# Altium schematic sheet MCU.SchDoc
size A
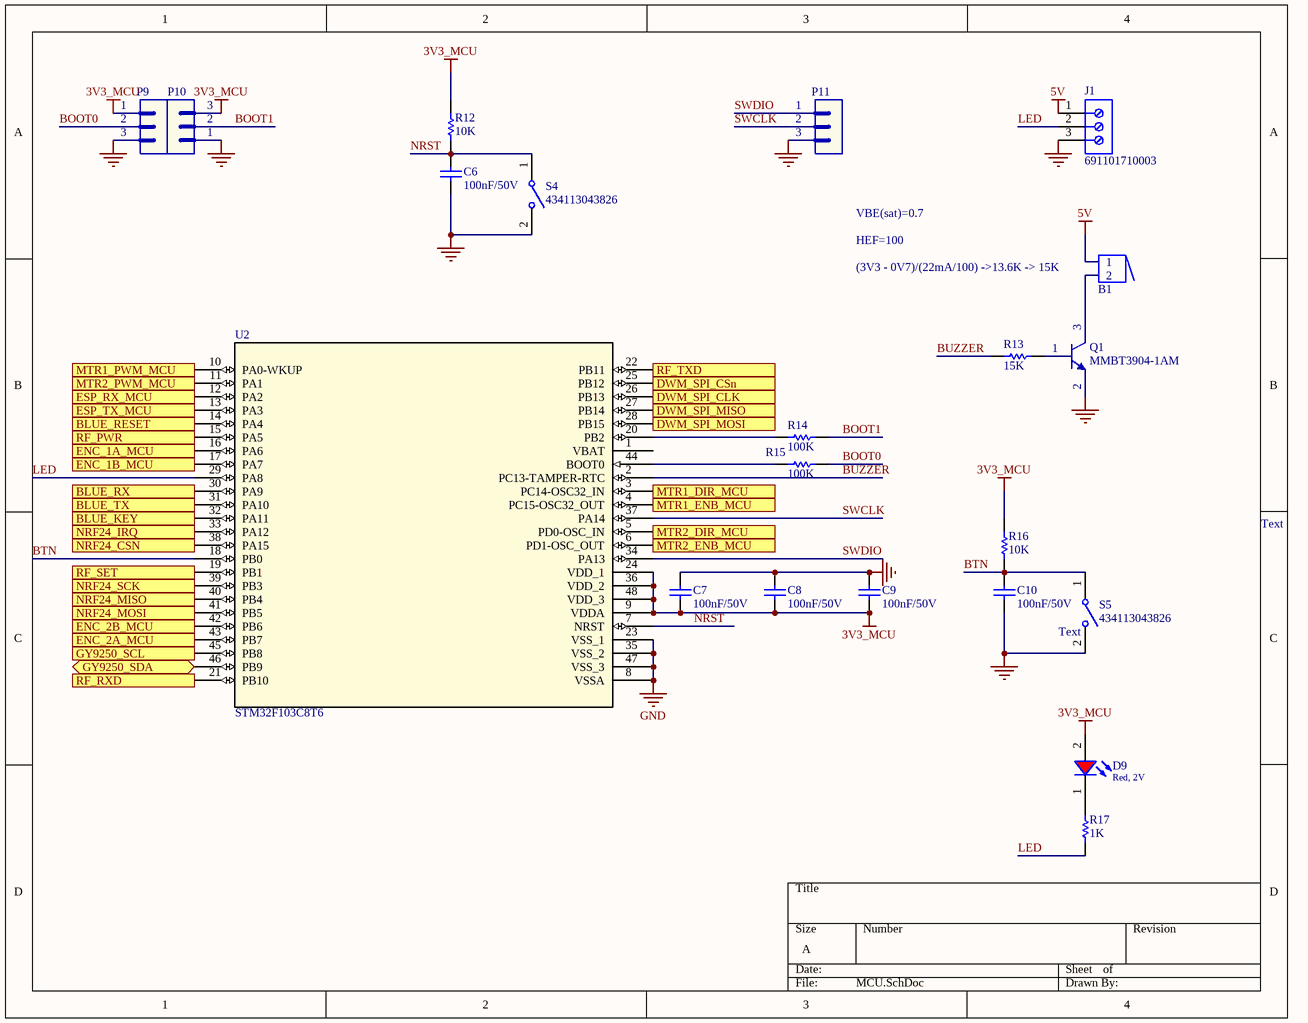
[diagram p0: MCU.SchDoc]

## Parts
B1  Buzzer  [BUZZER]  (value not drawn)
C6  value 100nF/50V  [CAP-SM-0805]  (hidden comment: Cap-100nF-50V-0805)
C7  value 100nF/50V  [CAP-SM-0805]  (hidden comment: Cap-100nF-50V-0805)
C8  value 100nF/50V  [CAP-SM-0805]  (hidden comment: Cap-100nF-50V-0805)
C9  value 100nF/50V  [CAP-SM-0805]  (hidden comment: Cap-100nF-50V-0805)
C10  value 100nF/50V  [CAP-SM-0805]  (hidden comment: Cap-100nF-50V-0805)
D9  Red, 2V  [WL-SMCW_0805]
J1  691101710003  [691101710003]
P9  (no value)  [JP3]
P10  (no value)  [JP3]
P11  (no value)  [JP3]
Q1  MMBT3904-1AM  [SOT23_NEX]
R12  value 10K  [RES-SM-0805]  (hidden comment: Res-10k-0805)
R13  value 15K  [RES-SM-0805]  (hidden comment: Res-15K-0805)
R14  value 100K  [RES-SM-0805]  (hidden comment: Res-100K-0805)
R15  value 100K  [RES-SM-0805]  (hidden comment: Res-100K-0805)
R16  value 10K  [RES-SM-0805]  (hidden comment: Res-10k-0805)
R17  value 1K  [RES-SM-0805]  (hidden comment: Res-1K-0805)
S4  434113043826  [434113043826]
S5  434113043826  [434113043826]
U2  STM32F103C8T6  [LQFP-48]

## Ports
BLUE_KEY (out), BLUE_RESET (out), BLUE_RX (out), BLUE_TX (in), DWM_SPI_CLK (out), DWM_SPI_CSn (out), DWM_SPI_MISO (in), DWM_SPI_MOSI (out), ENC_1A_MCU (in), ENC_1B_MCU (in), ENC_2A_MCU (in), ENC_2B_MCU (in), ESP_RX_MCU (out), ESP_TX_MCU (in), GY9250_SCL (out), GY9250_SDA (bidir), MTR1_DIR_MCU (out), MTR1_ENB_MCU (out), MTR1_PWM_MCU (out), MTR2_DIR_MCU (out), MTR2_ENB_MCU (out), MTR2_PWM_MCU (out), NRF24_CSN (out), NRF24_IRQ (in), NRF24_MISO (in), NRF24_MOSI (out), NRF24_SCK (out), RF_PWR (out), RF_RXD (out), RF_SET (out), RF_TXD (in)

## Nets
3V3_MCU: C7.1 C8.1 C9.1 D9.2(A) P9.1 P10.3 R12.1 R16.1 U2.9(VDDA) U2.24(VDD_1) U2.36(VDD_2) U2.48(VDD_3)
5V: B1.1 J1.1
GND: C6.1 C7.2 C8.2 C9.2 C10.1 J1.3 P9.3 P10.1 P11.3 Q1.2(E) S4.2 S5.2 U2.8(VSSA) U2.23(VSS_1) U2.35(VSS_2) U2.47(VSS_3)
BLUE_KEY: U2.32(PA11) ; port BLUE_KEY
BLUE_RESET: U2.14(PA4) ; port BLUE_RESET
BLUE_RX: U2.30(PA9) ; port BLUE_RX
BLUE_TX: U2.31(PA10) ; port BLUE_TX
BOOT0: P9.2 R15.2
BOOT1: P10.2 R14.2
BTN: C10.2 R16.2 S5.1 U2.18(PB0)
BUZZER: R13.1 U2.2(PC13-TAMPER-RTC)
DWM_SPI_CLK: U2.26(PB13) ; port DWM_SPI_CLK
DWM_SPI_CSn: U2.25(PB12) ; port DWM_SPI_CSn
DWM_SPI_MISO: U2.27(PB14) ; port DWM_SPI_MISO
DWM_SPI_MOSI: U2.28(PB15) ; port DWM_SPI_MOSI
ENC_1A_MCU: U2.16(PA6) ; port ENC_1A_MCU
ENC_1B_MCU: U2.17(PA7) ; port ENC_1B_MCU
ENC_2A_MCU: U2.43(PB7) ; port ENC_2A_MCU
ENC_2B_MCU: U2.42(PB6) ; port ENC_2B_MCU
ESP_RX_MCU: U2.12(PA2) ; port ESP_RX_MCU
ESP_TX_MCU: U2.13(PA3) ; port ESP_TX_MCU
GY9250_SCL: U2.45(PB8) ; port GY9250_SCL
GY9250_SDA: U2.46(PB9) ; port GY9250_SDA
LED: J1.2 R17.1 U2.29(PA8)
MTR1_DIR_MCU: U2.3(PC14-OSC32_IN) ; port MTR1_DIR_MCU
MTR1_ENB_MCU: U2.4(PC15-OSC32_OUT) ; port MTR1_ENB_MCU
MTR1_PWM_MCU: U2.10(PA0-WKUP) ; port MTR1_PWM_MCU
MTR2_DIR_MCU: U2.5(PD0-OSC_IN) ; port MTR2_DIR_MCU
MTR2_ENB_MCU: U2.6(PD1-OSC_OUT) ; port MTR2_ENB_MCU
MTR2_PWM_MCU: U2.11(PA1) ; port MTR2_PWM_MCU
NRF24_CSN: U2.38(PA15) ; port NRF24_CSN
NRF24_IRQ: U2.33(PA12) ; port NRF24_IRQ
NRF24_MISO: U2.40(PB4) ; port NRF24_MISO
NRF24_MOSI: U2.41(PB5) ; port NRF24_MOSI
NRF24_SCK: U2.39(PB3) ; port NRF24_SCK
NRST: C6.2 R12.2 S4.1 U2.7(NRST)
RF_PWR: U2.15(PA5) ; port RF_PWR
RF_RXD: U2.21(PB10) ; port RF_RXD
RF_SET: U2.19(PB1) ; port RF_SET
RF_TXD: U2.22(PB11) ; port RF_TXD
SWCLK: P11.2 U2.37(PA14)
SWDIO: P11.1 U2.34(PA13)
NetB1_2: B1.2 Q1.3(C)
NetD9_1: D9.1(K) R17.2
NetQ1_1: Q1.1(B) R13.2
NetR14_1: R14.1 U2.20(PB2)
NetR15_1: R15.1 U2.44(BOOT0)

Not connected (* = marked no-connect by the designer): U2 1(VBAT)

## Notes on the sheet
- VBE(sat)=0.7
- HEF=100
- (near B1) (3V3 - 0V7)/(22mA/100) ->13.6K -> 15K
- Text
- (near S5) Text

## Library data of the parts
C6-C10 = Cap-100nF-50V-0805: CAP CER 0.1UF 50V Y5V 0805; Manufacturer: Samsung Electro-Mechanics; Manufacturer Part Number: CL21F104ZBCNNNC; Local Supplier: thegioiic; Local Supplier Link: https://thegioiic.com/products/tu-100nf-0-1uf-50v-0805; Supplier 1: Digikey; Supplier 1 Part Number: 1276-1007-1-ND; Supplier 1 Link: https://www.digikey.com/product-detail/en/samsung-electro-mechanics/CL21F104ZBCNNNC/1276-1007-1-ND/3889093
D9 = 150080RS75000: WL-SMCW SMT Mono-color Chip LED Waterclear, size 0805, Red, 2V, 140deg; Chip Technology: AlInGaP; Dominant Wavelength typ.: 625nm; Luminous Intensity typ.: 150mcd; Peak Wavelength typ.: 630nm; Viewing Angle: 140deg; ComponentLink1Description: Manufacturer; ComponentLink1URL: http://www.we-online.de; ComponentLink2URL: https://www.we-online.com/catalog/datasheet/150080RS75000.pdf; ComponentLink2Description: Datasheet; Forward Voltage typ.: 2V; Emitting Color: Red; Mounting Technology: SMT; Operating Temperature: -40 to +85degC; Published Date: December 2019; Part Number: 150080RS75000; Packaging: Tape and Reel; Size: 0805; Publisher: Wurth Elektronik
J1 = 691101710003: WR-TBL Serie 101 Horizontal Entry Modular, Pressure Clamp, pitch 5mm, 3p; Compliance: Lead free / RoHS; Modularity: Yes; PCB/Cable/Panel: PCB; Pin Number: 3; Rated Current [UL]: 16A; Working Voltage [UL]: 250VAC; ComponentLink1Description: Manufacturer; ComponentLink1URL: http://www.we-online.de; ComponentLink2URL: https://katalog.we-online.de/em/datasheet/691101710003.pdf; ComponentLink2Description: Datasheet; Mounting Technology: THT; Part Number: 691101710003; Packaging: Box; Operating Temperature: -40 to +105degC; Pitch: 5mm; Published Date: October 2019; Type: Horizontal; Publisher: Wurth Elektronik; Application: Pressure Clamp
P9-P11 = Header 3: Header, 3-Pin; LatestRevisionDate: 17-Jul-2002; LatestRevisionNote: Re-released for DXP Platform.; Publisher: Altium Limited
R12 R16 = Res-10k-0805: RES 10K OHM 1% 1/4W 0805; Manufacturer: Stackpole Electronics Inc; Manufacturer Part Number: RNCP0805FTD10K0; Local Supplier: thegioiic; Local Supplier Link: https://thegioiic.com/products/dien-tro-10k-ohm-0805-5; Supplier 1: Digikey; Supplier 1 Link: https://www.digikey.com/product-detail/en/stackpole-electronics-inc/RNCP0805FTD10K0/RNCP0805FTD10K0CT-ND/2240601; Supplier 1 Part Number: RNCP0805FTD10K0CT-ND
R13 = Res-15K-0805: RES 15K OHM 1% 1/4W 0805; Manufacturer: TE Connectivity Passive Product; Manufacturer Part Number: CRGCQ0805F15K; Local Supplier: thegioiic; Local Supplier Link: https://thegioiic.com/products/dien-tro-15k-ohm-0805-1; Supplier 1: Digikey; Supplier 1 Part Number: A129763CT-ND; Supplier 1 Link: https://www.digikey.com/product-detail/en/te-connectivity-passive-product/CRGCQ0805F15K/A129763CT-ND/8577595
R14 R15 = Res-100K-0805: RES 0 OHM JUMPER 0805; Manufacturer: Vishay Dale; Manufacturer Part Number: WSL080500000ZEA9; Local Supplier: thegioiic; Local Supplier Link: https://thegioiic.com/products/dien-tro-0-ohm-0805-5; Supplier 1: Digikey; Supplier 1 Link: https://www.digikey.com/product-detail/en/vishay-dale/WSL080500000ZEA9/541-3928-1-ND/7423223; Supplier 1 Part Number: 541-3928-1-ND
R17 = Res-1K-0805: RES 1K OHM 1% 1/4W 0805; Manufacturer: Stackpole Electronics Inc; Manufacturer Part Number: RNCP0805FTD1K00; Local Supplier: thegioiic; Local Supplier Link: https://thegioiic.com/products/dien-tro-1k-ohm-0805-5; Supplier 1: Digikey; Supplier 1 Link: https://www.digikey.com/product-detail/en/stackpole-electronics-inc/RNCP0805FTD1K00/RNCP0805FTD1K00CT-ND/2240568; Supplier 1 Part Number: RNCP0805FTD1K00CT-ND
S4 S5 = 434113043826: WS-TASV J-Bend SMT Tact Switch 6x3.5mm, height 4.3mm, 260gf; Rated Voltage: 12VDC; Rated Current: 50mA; Washable: No; ComponentLink1Description: Manufacturer; ComponentLink1URL: http://www.we-online.de; ComponentLink2Description: Datasheet; ComponentLink2URL: https://katalog.we-online.com/em/datasheet/434113043826.pdf; Operating Temperature: -40 to +85degC; Part Number: 434113043826; Published Date: September 2019; Contact Material: Stainless Steel; Height: 4.3mm; Mounting Technology: SMT; Contact Plating: Silver; Operation Force: 260gf; Packaging: Tape and Reel; Terminal Material: Copper Alloy; Publisher: Wurth Elektronik; Terminal Plating: Silver
U2 = STM32F103C8T6: No Description Available; Vendor: STMicroelectronics; Built_By: EMA_UL_Team; Manufacturer_Part_Number: STM32F103C8T6; Copyright: Copyright (C) 2018 Accelerated Designs. All rights reserved; RefDes: RefDes; Type: DEV